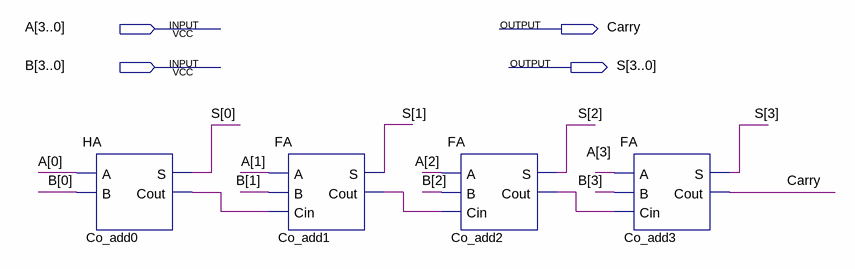
[diagram p0: schematic sheet]
// Quartus schematic RCA_4bits.bdf as structural Verilog: 4 symbols, 4 pins
module RCA_4bits (
  input  [3:0] A,
  input  [3:0] B,
  output Carry,
  output [3:0] S
);

  wire Co_add0_cout, Co_add1_cout, Co_add2_cout;

  HA Co_add0 (.A(A[0]), .B(B[0]), .S(S[0]), .Cout(Co_add0_cout));
  FA Co_add1 (.A(A[1]), .B(B[1]), .Cin(Co_add0_cout), .S(S[1]), .Cout(Co_add1_cout));
  FA Co_add2 (.A(A[2]), .B(B[2]), .Cin(Co_add1_cout), .S(S[2]), .Cout(Co_add2_cout));
  FA Co_add3 (.A(A[3]), .B(B[3]), .Cin(Co_add2_cout), .S(S[3]), .Cout(Carry));
endmodule
